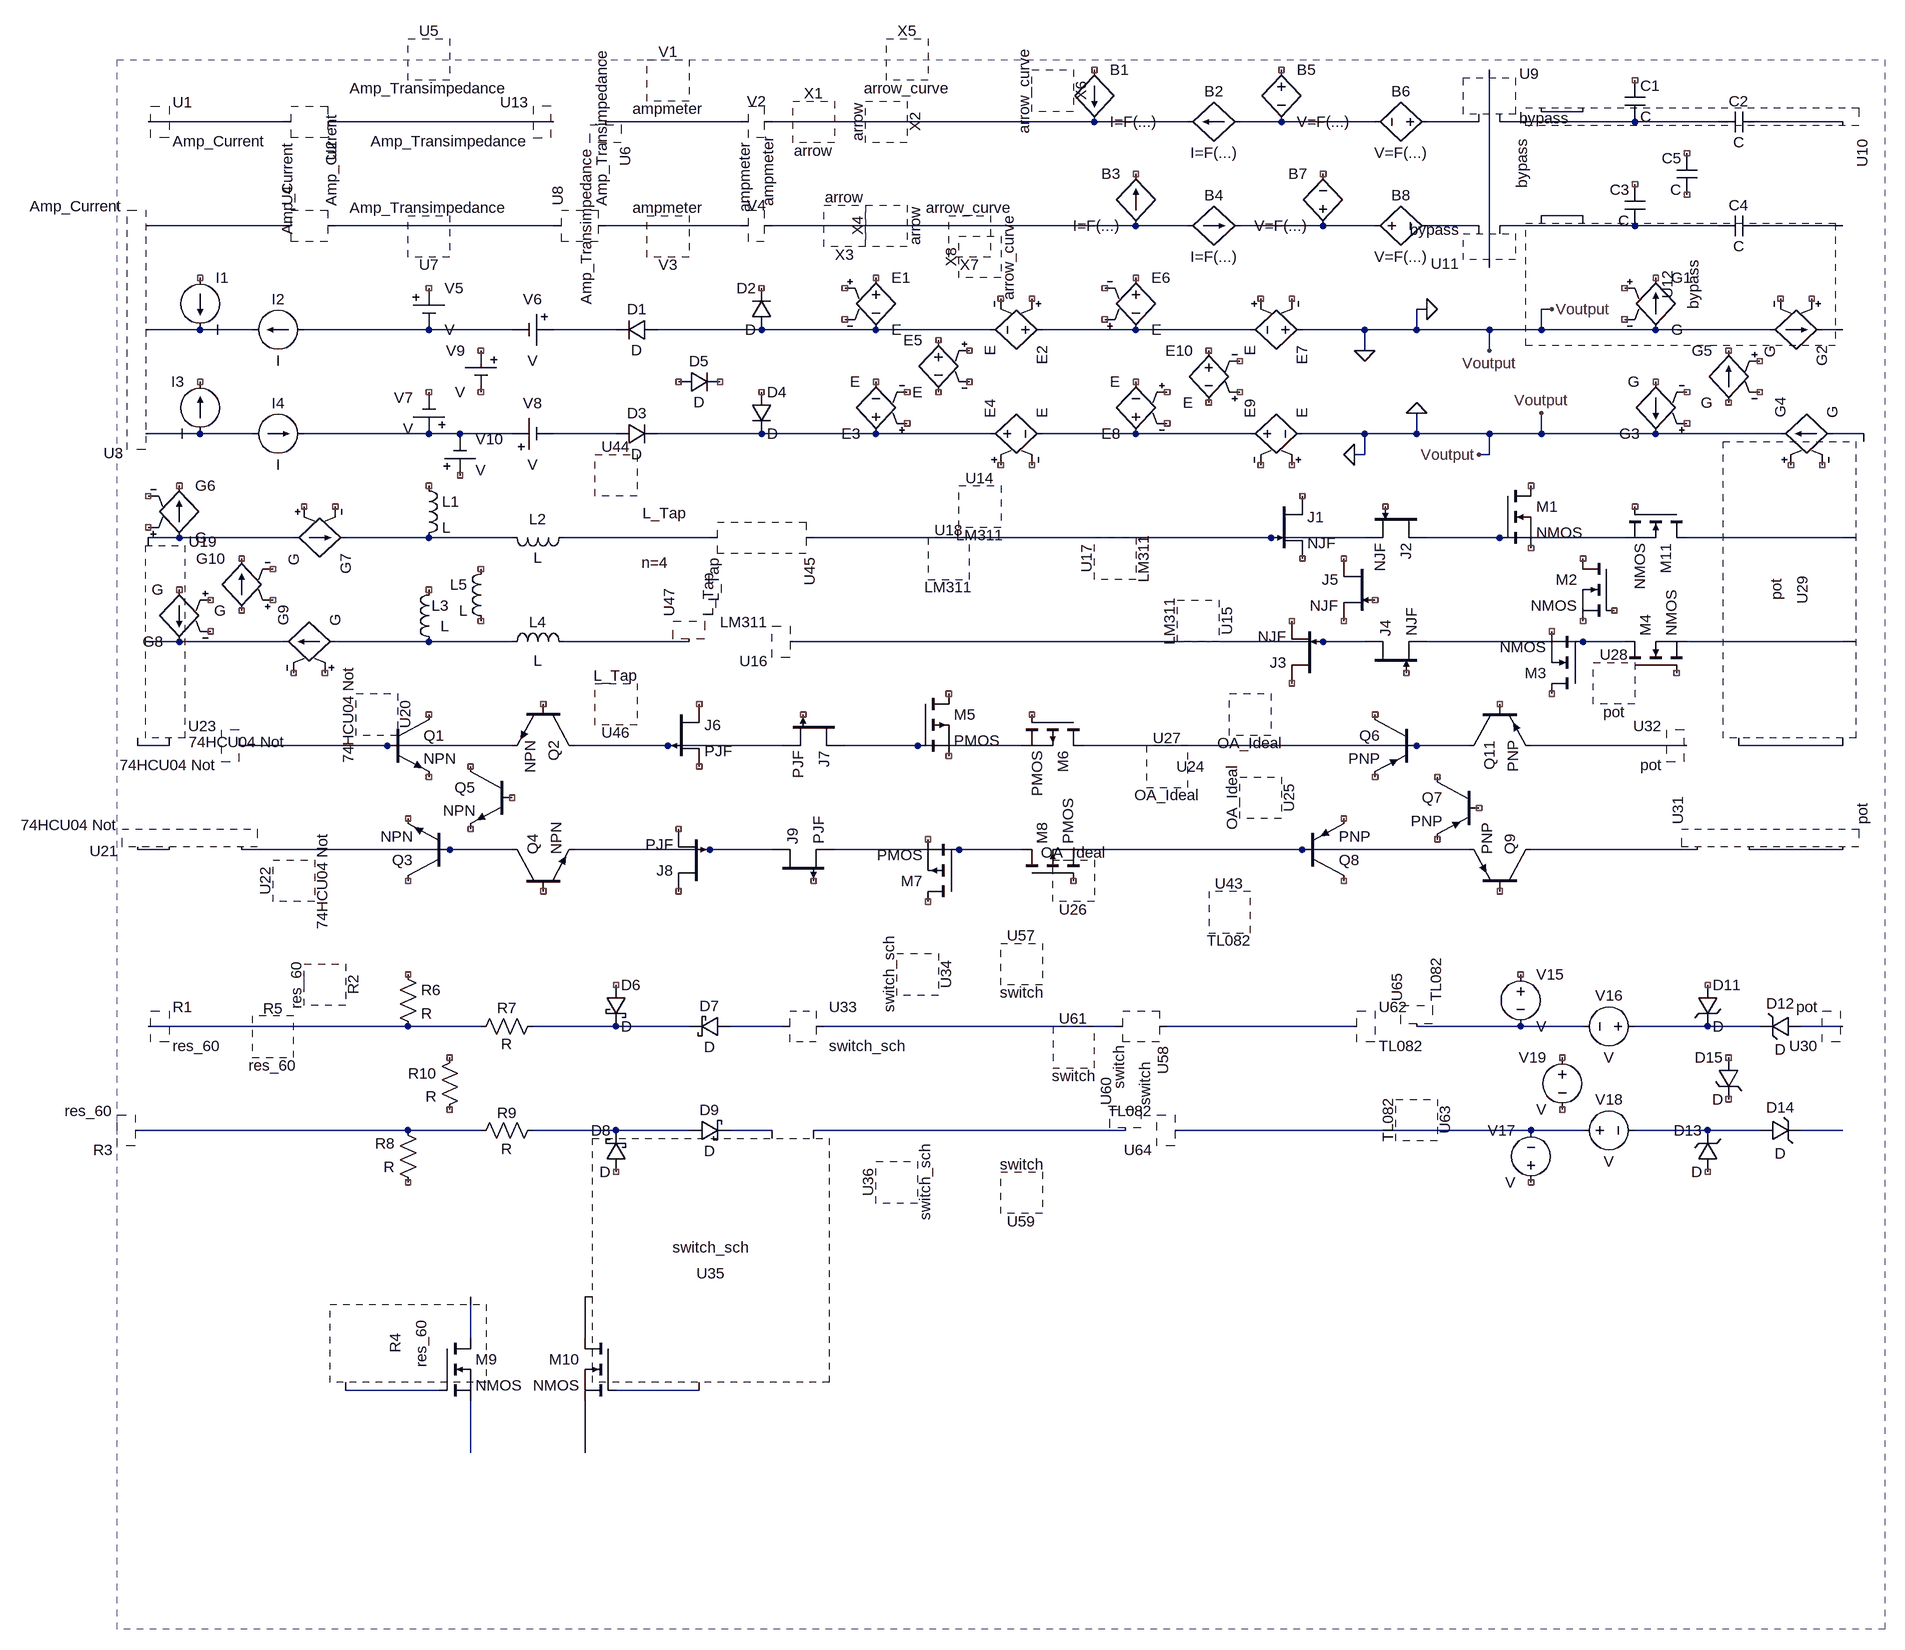
[diagram p0: schematic Full.asc]
Full.asc, the LTspice schematic file:
Version 4
SHEET 1 2724 2420
WIRE 2256 80 2192 80
WIRE 128 96 48 96
WIRE 256 96 128 96
WIRE 480 96 336 96
WIRE 672 96 480 96
WIRE 848 96 752 96
WIRE 960 96 848 96
WIRE 1504 96 1008 96
WIRE 1648 96 1504 96
WIRE 1792 96 1728 96
WIRE 1936 96 1792 96
WIRE 2096 96 2016 96
WIRE 2224 96 2128 96
WIRE 2336 96 2224 96
WIRE 2464 96 2336 96
WIRE 2656 96 2528 96
WIRE 2256 240 2192 240
WIRE 128 256 48 256
WIRE 256 256 128 256
WIRE 480 256 336 256
WIRE 672 256 480 256
WIRE 848 256 752 256
WIRE 960 256 848 256
WIRE 1568 256 1008 256
WIRE 1648 256 1568 256
WIRE 1856 256 1728 256
WIRE 1936 256 1856 256
WIRE 2096 256 2016 256
WIRE 2224 256 2128 256
WIRE 2336 256 2224 256
WIRE 2464 256 2336 256
WIRE 2656 256 2528 256
WIRE 2112 320 2112 16
WIRE 2016 384 2000 384
WIRE 2208 384 2192 384
WIRE 128 416 48 416
WIRE 208 416 128 416
WIRE 480 416 288 416
WIRE 608 416 480 416
WIRE 768 416 672 416
WIRE 992 416 832 416
WIRE 1168 416 992 416
WIRE 1344 416 1168 416
WIRE 1568 416 1424 416
WIRE 1744 416 1568 416
WIRE 1920 416 1824 416
WIRE 2000 416 2000 384
WIRE 2000 416 1920 416
WIRE 2112 416 2000 416
WIRE 2192 416 2192 384
WIRE 2192 416 2112 416
WIRE 2368 416 2192 416
WIRE 2544 416 2368 416
WIRE 2656 416 2624 416
WIRE 1920 448 1920 416
WIRE 2112 448 2112 416
WIRE 128 576 48 576
WIRE 208 576 128 576
WIRE 480 576 288 576
WIRE 528 576 480 576
WIRE 608 576 528 576
WIRE 768 576 672 576
WIRE 992 576 832 576
WIRE 1168 576 992 576
WIRE 1344 576 1168 576
WIRE 1568 576 1424 576
WIRE 1744 576 1568 576
WIRE 1920 576 1824 576
WIRE 2000 576 2000 544
WIRE 2000 576 1920 576
WIRE 2112 576 2000 576
WIRE 2192 576 2192 544
WIRE 2192 576 2112 576
WIRE 2368 576 2192 576
WIRE 2560 576 2368 576
WIRE 2688 576 2640 576
WIRE 1920 608 1920 576
WIRE 1920 608 1904 608
WIRE 2112 608 2112 576
WIRE 2112 608 2096 608
WIRE 96 736 48 736
WIRE 272 736 96 736
WIRE 480 736 352 736
WIRE 608 736 480 736
WIRE 752 736 688 736
WIRE 912 736 752 736
WIRE 1248 736 1072 736
WIRE 1776 736 1248 736
WIRE 1920 736 1776 736
WIRE 2128 736 2016 736
WIRE 2320 736 2128 736
WIRE 2656 736 2416 736
WIRE 96 896 48 896
WIRE 256 896 96 896
WIRE 480 896 336 896
WIRE 608 896 480 896
WIRE 784 896 688 896
WIRE 880 896 784 896
WIRE 1120 896 1040 896
WIRE 1856 896 1120 896
WIRE 1920 896 1856 896
WIRE 2256 896 2016 896
WIRE 2320 896 2256 896
WIRE 2656 896 2416 896
WIRE 80 1056 32 1056
WIRE 416 1056 192 1056
WIRE 608 1056 416 1056
WIRE 848 1056 704 1056
WIRE 1024 1056 848 1056
WIRE 1232 1056 1120 1056
WIRE 1392 1056 1232 1056
WIRE 1664 1056 1488 1056
WIRE 1712 1056 1664 1056
WIRE 2000 1056 1712 1056
WIRE 2080 1056 2000 1056
WIRE 2320 1056 2176 1056
WIRE 2416 1056 2320 1056
WIRE 2656 1056 2496 1056
WIRE 80 1216 32 1216
WIRE 512 1216 192 1216
WIRE 608 1216 512 1216
WIRE 912 1216 704 1216
WIRE 1008 1216 912 1216
WIRE 1296 1216 1104 1216
WIRE 1392 1216 1296 1216
WIRE 1552 1216 1488 1216
WIRE 1824 1216 1552 1216
WIRE 2080 1216 1824 1216
WIRE 2320 1216 2176 1216
WIRE 2432 1216 2320 1216
WIRE 2656 1216 2512 1216
WIRE 128 1488 48 1488
WIRE 224 1488 128 1488
WIRE 448 1488 224 1488
WIRE 560 1488 448 1488
WIRE 768 1488 640 1488
WIRE 880 1488 768 1488
WIRE 1024 1488 944 1488
WIRE 1216 1488 1088 1488
WIRE 1392 1488 1216 1488
WIRE 1536 1488 1392 1488
WIRE 1824 1488 1616 1488
WIRE 1904 1488 1824 1488
WIRE 2160 1488 2000 1488
WIRE 2256 1488 2160 1488
WIRE 2448 1488 2336 1488
WIRE 2528 1488 2448 1488
WIRE 2656 1488 2592 1488
WIRE 144 1648 32 1648
WIRE 240 1648 144 1648
WIRE 448 1648 240 1648
WIRE 560 1648 448 1648
WIRE 768 1648 640 1648
WIRE 880 1648 768 1648
WIRE 1008 1648 944 1648
WIRE 1216 1648 1072 1648
WIRE 1392 1648 1216 1648
WIRE 1552 1648 1392 1648
WIRE 1712 1648 1632 1648
WIRE 2176 1648 1712 1648
WIRE 2256 1648 2176 1648
WIRE 2448 1648 2336 1648
WIRE 2528 1648 2448 1648
WIRE 2656 1648 2592 1648
WIRE 544 1968 544 1904
WIRE 720 1968 720 1904
WIRE 496 2048 352 2048
WIRE 896 2048 768 2048
WIRE 544 2144 544 2064
WIRE 720 2144 720 2064
FLAG 1920 448 0
FLAG 2016 384 0
FLAG 1904 608 0
FLAG 2000 544 0
FLAG 2112 448 Voutput
FLAG 2208 384 Voutput
FLAG 2096 608 Voutput
FLAG 2192 544 Voutput
SYMBOL TCLib\\Amp_Current 128 0 R0
SYMATTR InstName U1
SYMBOL TCLib\\Amp_Current 352 96 R90
SYMATTR InstName U2
SYMBOL TCLib\\Amp_Current 128 272 R180
SYMATTR InstName U3
SYMBOL TCLib\\Amp_Current 240 256 R270
SYMATTR InstName U4
SYMBOL TCLib\\Amp_Transimpedance 480 0 R0
SYMATTR InstName U5
SYMBOL TCLib\\Amp_Transimpedance 768 96 R90
SYMATTR InstName U6
SYMBOL TCLib\\Amp_Transimpedance 480 272 R180
SYMATTR InstName U7
SYMBOL TCLib\\Amp_Transimpedance 656 256 R270
SYMATTR InstName U8
SYMBOL TCLib\\Special\\ampmeter 848 32 R0
SYMATTR InstName V1
SYMBOL TCLib\\Special\\ampmeter 1024 96 R90
WINDOW 0 -16 40 VBottom 2
SYMATTR InstName V2
SYMBOL TCLib\\Special\\ampmeter 848 272 R180
SYMATTR InstName V3
SYMBOL TCLib\\Special\\ampmeter 944 256 R270
WINDOW 0 16 40 VTop 2
SYMATTR InstName V4
SYMBOL TCLib\\Special\\arrow 1072 96 R0
SYMATTR InstName X1
SYMBOL TCLib\\Special\\arrow 1184 96 R90
SYMATTR InstName X2
SYMBOL TCLib\\Special\\arrow 1120 256 R180
SYMATTR InstName X3
SYMBOL TCLib\\Special\\arrow 1184 256 R270
SYMATTR InstName X4
SYMBOL TCLib\\Special\\arrow_curve 1216 0 R0
SYMATTR InstName X5
SYMBOL TCLib\\Special\\arrow_curve 1440 48 R90
SYMATTR InstName X6
SYMBOL TCLib\\Special\\arrow_curve 1312 272 R180
SYMATTR InstName X7
SYMBOL TCLib\\Special\\arrow_curve 1328 304 R270
SYMATTR InstName X8
SYMBOL bi 1504 16 R0
SYMATTR InstName B1
SYMBOL bi 1728 96 R90
WINDOW 0 -32 40 VBottom 2
WINDOW 3 32 40 VTop 2
SYMATTR InstName B2
SYMBOL bi 1568 256 R180
WINDOW 0 24 80 Left 2
WINDOW 3 24 0 Left 2
SYMATTR InstName B3
SYMBOL bi 1648 256 R270
WINDOW 0 32 40 VTop 2
WINDOW 3 -32 40 VBottom 2
SYMATTR InstName B4
SYMBOL bv 1792 0 R0
SYMATTR InstName B5
SYMBOL bv 2032 96 R90
WINDOW 0 -32 56 VBottom 2
WINDOW 3 32 56 VTop 2
SYMATTR InstName B6
SYMBOL bv 1856 272 R180
WINDOW 0 24 96 Left 2
WINDOW 3 24 16 Left 2
SYMATTR InstName B7
SYMBOL bv 1920 256 R270
WINDOW 0 32 56 VTop 2
WINDOW 3 -32 56 VBottom 2
SYMATTR InstName B8
SYMBOL TCLib\\Special\\bypass 2096 96 R0
SYMATTR InstName U9
SYMBOL TCLib\\Special\\bypass 2224 64 R90
SYMATTR InstName U10
SYMBOL TCLib\\Special\\bypass 2128 256 R180
SYMATTR InstName U11
SYMBOL TCLib\\Special\\bypass 2224 256 R270
SYMATTR InstName U12
SYMBOL current 128 336 R0
SYMATTR InstName I1
SYMBOL current 288 416 R90
WINDOW 0 -32 40 VBottom 2
WINDOW 3 32 40 VTop 2
SYMATTR InstName I2
SYMBOL current 208 576 R270
WINDOW 0 32 40 VTop 2
WINDOW 3 -32 40 VBottom 2
SYMATTR InstName I4
SYMBOL current 128 576 R180
WINDOW 0 24 80 Left 2
WINDOW 3 24 0 Left 2
SYMATTR InstName I3
SYMBOL Misc\\cell 480 352 R0
SYMATTR InstName V5
SYMBOL Misc\\cell 672 416 R90
WINDOW 0 -32 32 VBottom 2
WINDOW 3 32 32 VTop 2
SYMATTR InstName V6
SYMBOL Misc\\cell 480 576 R180
WINDOW 0 24 56 Left 2
WINDOW 3 24 8 Left 2
SYMATTR InstName V7
SYMBOL Misc\\cell 608 576 R270
WINDOW 0 32 32 VTop 2
WINDOW 3 -32 32 VBottom 2
SYMATTR InstName V8
SYMBOL Misc\\cell 560 448 M0
SYMATTR InstName V9
SYMBOL TCLib\\Amp_Transimpedance 608 112 M0
SYMATTR InstName U13
SYMBOL diode 832 400 R90
WINDOW 0 0 32 VBottom 2
WINDOW 3 32 32 VTop 2
SYMATTR InstName D1
SYMBOL diode 1008 416 R180
WINDOW 0 24 64 Left 2
WINDOW 3 24 0 Left 2
SYMATTR InstName D2
SYMBOL diode 768 592 R270
WINDOW 0 32 32 VTop 2
WINDOW 3 0 32 VBottom 2
SYMATTR InstName D3
SYMBOL diode 976 512 R0
SYMATTR InstName D4
SYMBOL diode 864 480 M90
WINDOW 0 0 32 VBottom 2
WINDOW 3 32 32 VTop 2
SYMATTR InstName D5
SYMBOL e 1168 320 R0
SYMATTR InstName E1
SYMBOL e 1440 416 R90
SYMATTR InstName E2
SYMBOL e 1168 592 R180
SYMATTR InstName E3
SYMBOL e 1328 576 R270
SYMATTR InstName E4
SYMBOL e 1264 416 M0
SYMATTR InstName E5
SYMBOL e2 1568 320 R0
SYMATTR InstName E6
SYMBOL e2 1840 416 R90
SYMATTR InstName E7
SYMBOL e2 1568 592 R180
SYMATTR InstName E8
SYMBOL e2 1728 576 R270
SYMATTR InstName E9
SYMBOL e2 1680 432 M0
SYMATTR InstName E10
SYMBOL cap 2320 32 R0
SYMATTR InstName C1
SYMBOL cap 2528 80 R90
WINDOW 0 0 32 VBottom 2
WINDOW 3 32 32 VTop 2
SYMATTR InstName C2
SYMBOL cap 2352 256 R180
WINDOW 0 24 56 Left 2
WINDOW 3 24 8 Left 2
SYMATTR InstName C3
SYMBOL cap 2464 272 R270
WINDOW 0 32 32 VTop 2
WINDOW 3 0 32 VBottom 2
SYMATTR InstName C4
SYMBOL cap 2432 144 M0
SYMATTR InstName C5
SYMBOL g 2368 320 R0
SYMATTR InstName G1
SYMBOL g 2640 416 R90
SYMATTR InstName G2
SYMBOL g 2368 592 R180
SYMATTR InstName G3
SYMBOL g 2544 576 R270
SYMATTR InstName G4
SYMBOL g 2480 432 M0
SYMATTR InstName G5
SYMBOL g2 96 640 R0
SYMATTR InstName G6
SYMBOL g2 368 736 R90
SYMATTR InstName G7
SYMBOL g2 96 912 R180
SYMATTR InstName G8
SYMBOL g2 240 896 R270
SYMATTR InstName G9
SYMBOL g2 192 752 M0
SYMATTR InstName G10
SYMBOL ind 464 640 R0
SYMATTR InstName L1
SYMBOL ind 704 720 R90
WINDOW 3 31 56 VTop 2
WINDOW 0 3 56 VBottom 2
SYMATTR InstName L2
SYMBOL ind 496 912 R180
WINDOW 3 -2 40 Right 2
WINDOW 0 -2 72 Center 2
SYMATTR InstName L3
SYMBOL ind 592 912 R270
WINDOW 3 3 56 VBottom 2
WINDOW 0 31 56 VTop 2
SYMATTR InstName L4
SYMBOL ind 576 768 M0
SYMATTR InstName L5
SYMBOL TCLib\\LM311 1328 688 R0
SYMATTR InstName U14
SYMBOL TCLib\\LM311 1664 864 R90
SYMATTR InstName U15
SYMBOL TCLib\\LM311 1040 944 R180
SYMATTR InstName U16
SYMBOL TCLib\\LM311 1536 768 R270
SYMATTR InstName U17
SYMBOL TCLib\\LM311 1280 768 M0
SYMATTR InstName U18
SYMBOL TCLib\\Special\\74HCU04\ Not 128 992 R0
SYMATTR InstName U19
SYMBOL TCLib\\Special\\74HCU04\ Not 400 1008 R90
SYMATTR InstName U20
SYMBOL TCLib\\Special\\74HCU04\ Not 144 1280 R180
SYMATTR InstName U21
SYMBOL TCLib\\Special\\74HCU04\ Not 272 1264 R270
SYMATTR InstName U22
SYMBOL TCLib\\Special\\74HCU04\ Not 256 1072 M0
SYMATTR InstName U23
SYMBOL npn 416 1008 R0
SYMATTR InstName Q1
SYMBOL npn 704 992 R90
SYMATTR InstName Q2
SYMBOL npn 512 1264 R180
SYMATTR InstName Q3
SYMBOL npn 608 1280 R270
SYMATTR InstName Q4
SYMBOL npn 608 1088 M0
SYMATTR InstName Q5
SYMBOL TCLib\\TL082 1712 1312 M0
SYMATTR InstName U43
SYMBOL TCLib\\Special\\L_Tap 768 640 R0
WINDOW 3 41 58 Left 2
WINDOW 123 39 134 Left 2
SYMATTR Value2 n=4
SYMATTR InstName U44
SYMBOL TCLib\\Special\\L_Tap 1088 720 R90
SYMATTR InstName U45
SYMBOL TCLib\\Special\\L_Tap 768 992 R180
SYMATTR InstName U46
SYMBOL TCLib\\Special\\L_Tap 864 912 R270
SYMATTR InstName U47
SYMBOL res 432 1392 R0
SYMATTR InstName R6
SYMBOL res 656 1472 R90
WINDOW 0 3 56 VBottom 2
WINDOW 3 27 56 VTop 2
SYMATTR InstName R7
SYMBOL res 464 1744 R180
WINDOW 0 36 76 Left 2
WINDOW 3 36 40 Left 2
SYMATTR InstName R8
SYMBOL res 544 1664 R270
WINDOW 0 27 56 VTop 2
WINDOW 3 3 56 VBottom 2
SYMATTR InstName R9
SYMBOL res 528 1520 M0
SYMATTR InstName R10
SYMBOL TCLib\\switch 1392 1392 R0
SYMATTR InstName U57
SYMBOL TCLib\\switch 1632 1488 R90
SYMATTR InstName U58
SYMBOL TCLib\\switch 1392 1744 R180
SYMATTR InstName U59
SYMBOL TCLib\\switch 1536 1648 R270
SYMATTR InstName U60
SYMBOL TCLib\\switch 1472 1520 M0
SYMATTR InstName U61
SYMBOL TCLib\\TL082 1904 1440 R0
SYMATTR InstName U62
SYMBOL TCLib\\TL082 2000 1632 R90
SYMATTR InstName U63
SYMBOL TCLib\\TL082 1632 1696 R180
SYMATTR InstName U64
SYMBOL TCLib\\TL082 1920 1536 R270
SYMATTR InstName U65
SYMBOL voltage 2160 1392 R0
SYMATTR InstName V15
SYMBOL voltage 2352 1488 R90
WINDOW 0 -32 56 VBottom 2
WINDOW 3 32 56 VTop 2
SYMATTR InstName V16
SYMBOL voltage 2176 1744 R180
WINDOW 0 24 96 Left 2
WINDOW 3 24 16 Left 2
SYMATTR InstName V17
SYMBOL voltage 2240 1648 R270
WINDOW 0 32 56 VTop 2
WINDOW 3 -32 56 VBottom 2
SYMATTR InstName V18
SYMBOL voltage 2224 1520 M0
SYMATTR InstName V19
SYMBOL zener 2432 1424 R0
SYMATTR InstName D11
SYMBOL zener 2592 1472 R90
WINDOW 0 -4 32 VBottom 2
WINDOW 3 36 32 VTop 2
SYMATTR InstName D12
SYMBOL zener 2464 1712 R180
WINDOW 0 24 64 Left 2
WINDOW 3 24 0 Left 2
SYMATTR InstName D13
SYMBOL zener 2528 1664 R270
WINDOW 0 36 32 VTop 2
WINDOW 3 -4 32 VBottom 2
SYMATTR InstName D14
SYMBOL zener 2496 1536 M0
SYMATTR InstName D15
SYMBOL njf 1776 672 R0
SYMATTR InstName J1
SYMBOL njf 2016 688 R90
SYMATTR InstName J2
SYMBOL njf 1856 960 R180
SYMATTR InstName J3
SYMBOL njf 1920 944 R270
SYMATTR InstName J4
SYMBOL nmos 2128 656 R0
SYMATTR InstName M1
SYMBOL nmos 2256 976 R180
SYMATTR InstName M3
SYMBOL nmos 2320 944 R270
SYMATTR InstName M4
SYMBOL pjf 848 992 R0
SYMATTR InstName J6
SYMBOL pjf 1120 1008 R90
SYMATTR InstName J7
SYMBOL pjf 912 1280 R180
SYMATTR InstName J8
SYMBOL pjf 1008 1264 R270
SYMATTR InstName J9
SYMBOL pmos 1232 976 R0
SYMATTR InstName M5
SYMBOL pmos 1488 1008 R90
SYMATTR InstName M6
SYMBOL pmos 1296 1296 R180
SYMATTR InstName M7
SYMBOL pmos 1392 1264 R270
SYMATTR InstName M8
SYMBOL TCLib\\OA_Ideal 1744 1008 R0
WINDOW 0 -114 80 Left 2
SYMATTR InstName U24
SYMBOL TCLib\\OA_Ideal 1760 1136 R90
SYMATTR InstName U25
SYMBOL TCLib\\OA_Ideal 1472 1264 R180
SYMATTR InstName U26
SYMBOL TCLib\\OA_Ideal 1616 1088 M0
SYMATTR InstName U27
SYMBOL pnp 2000 1008 M0
SYMATTR InstName Q6
SYMBOL pnp 2080 992 M90
SYMATTR InstName Q11
SYMBOL pnp 1824 1264 M180
SYMATTR InstName Q8
SYMBOL pnp 2176 1280 M270
SYMATTR InstName Q9
SYMBOL pnp 2096 1104 M0
SYMATTR InstName Q7
SYMBOL TCLib\\pot 2304 960 R0
SYMATTR InstName U28
SYMBOL TCLib\\pot 2512 1040 R90
SYMATTR InstName U29
SYMBOL TCLib\\pot 2336 1312 R180
SYMATTR InstName U30
SYMBOL TCLib\\pot 2416 1232 R270
SYMATTR InstName U31
SYMBOL TCLib\\pot 2384 1088 M0
SYMATTR InstName U32
SYMBOL schottky 752 1424 R0
SYMATTR InstName D6
SYMBOL schottky 944 1472 R90
WINDOW 0 0 32 VBottom 2
WINDOW 3 32 32 VTop 2
SYMATTR InstName D7
SYMBOL schottky 784 1712 R180
WINDOW 0 24 64 Left 2
WINDOW 3 24 0 Left 2
SYMATTR InstName D8
SYMBOL schottky 880 1664 R270
WINDOW 0 32 32 VTop 2
WINDOW 3 0 32 VBottom 2
SYMATTR InstName D9
SYMBOL TCLib\\Special\\switch_sch 1008 1472 R0
SYMATTR InstName U33
SYMBOL TCLib\\Special\\switch_sch 1232 1408 R90
SYMATTR InstName U34
SYMBOL TCLib\\Special\\switch_sch 1088 1664 R180
SYMATTR InstName U35
SYMBOL TCLib\\Special\\switch_sch 1200 1728 R270
SYMATTR InstName U36
SYMBOL nmos 496 1968 R0
SYMATTR InstName M9
SYMBOL nmos 768 1968 M0
SYMATTR InstName M10
SYMBOL TCLib\\Special\\res_60 64 1392 R0
SYMATTR InstName R1
SYMBOL TCLib\\Special\\res_60 320 1424 R90
SYMATTR InstName R2
SYMBOL TCLib\\Special\\res_60 160 1664 R180
SYMATTR InstName R3
SYMBOL TCLib\\Special\\res_60 224 1664 R270
SYMATTR InstName R4
SYMBOL Misc\\cell 528 640 M180
WINDOW 0 24 56 Left 2
WINDOW 3 24 8 Left 2
SYMATTR InstName V10
SYMBOL njf 1936 768 M0
SYMATTR InstName J5
SYMBOL nmos 2304 768 M0
SYMATTR InstName M2
SYMBOL nmos 2416 688 R90
SYMATTR InstName M11
SYMBOL TCLib\\Special\\res_60 240 1504 M0
SYMATTR InstName R5
RECTANGLE Normal 2720 2416 0 0 2

The netlist it stands for:
* Full.asc
* U1: Amp_Current (symbol TCLib\Amp_Current not available, pin order unknown); nets seen at it: N002
* U2: Amp_Current (symbol TCLib\Amp_Current not available, pin order unknown); nets seen at it: N002, N003
* U3: Amp_Current (symbol TCLib\Amp_Current not available, pin order unknown); nets seen at it: N011, N020, N026
* U4: Amp_Current (symbol TCLib\Amp_Current not available, pin order unknown); nets seen at it: N011, N012
* U5: Amp_Transimpedance (symbol TCLib\Amp_Transimpedance not available, pin order unknown); nets seen at it: 
* U6: Amp_Transimpedance (symbol TCLib\Amp_Transimpedance not available, pin order unknown); nets seen at it: N004
* U7: Amp_Transimpedance (symbol TCLib\Amp_Transimpedance not available, pin order unknown); nets seen at it: 
* U8: Amp_Transimpedance (symbol TCLib\Amp_Transimpedance not available, pin order unknown); nets seen at it: N012, N013
* V1: ampmeter (symbol TCLib\Special\ampmeter not available, pin order unknown); nets seen at it: 
* V2: ampmeter (symbol TCLib\Special\ampmeter not available, pin order unknown); nets seen at it: N004, N005
* V3: ampmeter (symbol TCLib\Special\ampmeter not available, pin order unknown); nets seen at it: 
* V4: ampmeter (symbol TCLib\Special\ampmeter not available, pin order unknown); nets seen at it: N013, N014
* X1: arrow (symbol TCLib\Special\arrow not available, pin order unknown); nets seen at it: 
* X2: arrow (symbol TCLib\Special\arrow not available, pin order unknown); nets seen at it: 
* X3: arrow (symbol TCLib\Special\arrow not available, pin order unknown); nets seen at it: 
* X4: arrow (symbol TCLib\Special\arrow not available, pin order unknown); nets seen at it: 
* X5: arrow_curve (symbol TCLib\Special\arrow_curve not available, pin order unknown); nets seen at it: 
* X6: arrow_curve (symbol TCLib\Special\arrow_curve not available, pin order unknown); nets seen at it: 
* X7: arrow_curve (symbol TCLib\Special\arrow_curve not available, pin order unknown); nets seen at it: 
* X8: arrow_curve (symbol TCLib\Special\arrow_curve not available, pin order unknown); nets seen at it: 
B1 NC_01 N005 I=F(...)
B2 N006 N005 I=F(...)
B3 N014 NC_02 I=F(...)
B4 N014 N015 I=F(...)
B5 NC_03 N006 V=F(...)
B6 N007 N006 V=F(...)
B7 N015 NC_04 V=F(...)
B8 N015 N016 V=F(...)
* U9: bypass (symbol TCLib\Special\bypass not available, pin order unknown); nets seen at it: N007, N008, N019
* U10: bypass (symbol TCLib\Special\bypass not available, pin order unknown); nets seen at it: N001, N009
* U11: bypass (symbol TCLib\Special\bypass not available, pin order unknown); nets seen at it: N016, N017, N019
* U12: bypass (symbol TCLib\Special\bypass not available, pin order unknown); nets seen at it: N010, N018, N025
I1 NC_05 N020 I
I2 N021 N020 I
I4 N026 N027 I
I3 N026 NC_06 I
V5 NC_07 N021 V
V6 N022 N021 V
V7 N027 NC_08 V
V8 N027 N028 V
V9 NC_09 NC_10 V
* U13: Amp_Transimpedance (symbol TCLib\Amp_Transimpedance not available, pin order unknown); nets seen at it: N003
D1 N023 N022 D
D2 N023 NC_11 D
D3 N028 N029 D
D4 NC_12 N029 D
D5 NC_13 NC_14 D
E1 NC_15 N023 NC_16 NC_17 E
E2 N024 N023 NC_18 NC_19 E
E3 N029 NC_20 NC_21 NC_22 E
E4 N029 N030 NC_23 NC_24 E
E5 NC_25 NC_26 NC_27 NC_28 E
E6 NC_29 N024 NC_30 NC_31 E
E7 0 N024 NC_32 NC_33 E
E8 N030 NC_34 NC_35 NC_36 E
E9 N030 0 NC_37 NC_38 E
E10 NC_39 NC_40 NC_41 NC_42 E
C1 NC_43 N008 C
C2 N009 N008 C
C3 N017 NC_44 C
C4 N017 N018 C
C5 NC_45 NC_46 C
G1 0 NC_47 NC_48 NC_49 G
G2 0 N025 NC_50 NC_51 G
G3 NC_52 0 NC_53 NC_54 G
G4 N031 0 NC_55 NC_56 G
G5 NC_57 NC_58 NC_59 NC_60 G
G6 N032 NC_61 NC_62 NC_63 G
G7 N032 N033 NC_64 NC_65 G
G8 NC_66 N038 NC_67 NC_68 G
G9 N039 N038 NC_69 NC_70 G
G10 NC_71 NC_72 NC_73 NC_74 G
L1 NC_75 N033 L
L2 N034 N033 L
L3 N039 NC_76 L
L4 N039 N040 L
L5 NC_77 NC_78 L
* U14: LM311 (symbol TCLib\LM311 not available, pin order unknown); nets seen at it: 
* U15: LM311 (symbol TCLib\LM311 not available, pin order unknown); nets seen at it: 
* U16: LM311 (symbol TCLib\LM311 not available, pin order unknown); nets seen at it: N041
* U17: LM311 (symbol TCLib\LM311 not available, pin order unknown); nets seen at it: 
* U18: LM311 (symbol TCLib\LM311 not available, pin order unknown); nets seen at it: 
* U19: 74HCU04 Not (symbol TCLib\Special\74HCU04 Not not available, pin order unknown); nets seen at it: N032, N038, N044
* U20: 74HCU04 Not (symbol TCLib\Special\74HCU04 Not not available, pin order unknown); nets seen at it: 
* U21: 74HCU04 Not (symbol TCLib\Special\74HCU04 Not not available, pin order unknown); nets seen at it: N051, N052
* U22: 74HCU04 Not (symbol TCLib\Special\74HCU04 Not not available, pin order unknown); nets seen at it: 
* U23: 74HCU04 Not (symbol TCLib\Special\74HCU04 Not not available, pin order unknown); nets seen at it: N045
Q1 NC_79 N045 NC_80 0 NPN
Q2 N046 NC_81 N045 0 NPN
Q3 NC_82 N052 NC_83 0 NPN
Q4 N052 NC_84 N053 0 NPN
Q5 NC_85 NC_86 NC_87 0 NPN
* U43: TL082 (symbol TCLib\TL082 not available, pin order unknown); nets seen at it: 
* U44: n=4 (symbol TCLib\Special\L_Tap not available, pin order unknown); nets seen at it: 
* U45: L_Tap (symbol TCLib\Special\L_Tap not available, pin order unknown); nets seen at it: N034, N035
* U46: L_Tap (symbol TCLib\Special\L_Tap not available, pin order unknown); nets seen at it: 
* U47: L_Tap (symbol TCLib\Special\L_Tap not available, pin order unknown); nets seen at it: N040
R6 NC_88 N058 R
R7 N059 N058 R
R8 NC_89 N066 R
R9 N066 N067 R
R10 NC_90 NC_91 R
* U57: switch (symbol TCLib\switch not available, pin order unknown); nets seen at it: 
* U58: switch (symbol TCLib\switch not available, pin order unknown); nets seen at it: N061, N062
* U59: switch (symbol TCLib\switch not available, pin order unknown); nets seen at it: 
* U60: switch (symbol TCLib\switch not available, pin order unknown); nets seen at it: N069
* U61: switch (symbol TCLib\switch not available, pin order unknown); nets seen at it: 
* U62: TL082 (symbol TCLib\TL082 not available, pin order unknown); nets seen at it: N062
* U63: TL082 (symbol TCLib\TL082 not available, pin order unknown); nets seen at it: 
* U64: TL082 (symbol TCLib\TL082 not available, pin order unknown); nets seen at it: N070
* U65: TL082 (symbol TCLib\TL082 not available, pin order unknown); nets seen at it: N063
V15 NC_92 N063 V
V16 N064 N063 V
V17 NC_93 N070 V
V18 N070 N071 V
V19 NC_94 NC_95 V
D11 NC_96 N064 D
D12 N065 N064 D
D13 NC_97 N071 D
D14 N071 N072 D
D15 NC_98 NC_99 D
J1 NC_100 N035 NC_101 NJF
J2 N036 NC_102 N035 NJF
J3 NC_103 N041 NC_104 NJF
J4 N041 NC_105 N042 NJF
M1 NC_106 N036 NC_107 NC_107 NMOS
M3 NC_108 N042 NC_109 NC_109 NMOS
M4 N042 NC_110 N043 N043 NMOS
J6 NC_111 N046 NC_112 PJF
J7 N047 NC_113 N046 PJF
J8 NC_114 N053 NC_115 PJF
J9 N053 NC_116 N054 PJF
M5 NC_117 N047 NC_118 NC_118 PMOS
M6 N048 NC_119 N047 N047 PMOS
M7 NC_120 N054 NC_121 NC_121 PMOS
M8 N054 NC_122 N055 N055 PMOS
* U24: OA_Ideal (symbol TCLib\OA_Ideal not available, pin order unknown); nets seen at it: 
* U25: OA_Ideal (symbol TCLib\OA_Ideal not available, pin order unknown); nets seen at it: 
* U26: OA_Ideal (symbol TCLib\OA_Ideal not available, pin order unknown); nets seen at it: 
* U27: OA_Ideal (symbol TCLib\OA_Ideal not available, pin order unknown); nets seen at it: 
Q6 NC_123 N048 NC_124 0 PNP
Q11 N048 NC_125 N049 0 PNP
Q8 NC_126 N055 NC_127 0 PNP
Q9 N056 NC_128 N055 0 PNP
Q7 NC_129 NC_130 NC_131 0 PNP
* U28: pot (symbol TCLib\pot not available, pin order unknown); nets seen at it: 
* U29: pot (symbol TCLib\pot not available, pin order unknown); nets seen at it: N031, N037, N043, N050
* U30: pot (symbol TCLib\pot not available, pin order unknown); nets seen at it: N065
* U31: pot (symbol TCLib\pot not available, pin order unknown); nets seen at it: N056, N057
* U32: pot (symbol TCLib\pot not available, pin order unknown); nets seen at it: N049
D6 NC_132 N059 D
D7 N060 N059 D
D8 NC_133 N067 D
D9 N067 N068 D
* U33: switch_sch (symbol TCLib\Special\switch_sch not available, pin order unknown); nets seen at it: N060, N061
* U34: switch_sch (symbol TCLib\Special\switch_sch not available, pin order unknown); nets seen at it: 
* U35: switch_sch (symbol TCLib\Special\switch_sch not available, pin order unknown); nets seen at it: N068, N069, N074, N076
* U36: switch_sch (symbol TCLib\Special\switch_sch not available, pin order unknown); nets seen at it: 
M9 N073 N075 N077 N077 NMOS
M10 N074 N076 N078 N078 NMOS
* R1: res_60 (symbol TCLib\Special\res_60 not available, pin order unknown); nets seen at it: N058
* R2: res_60 (symbol TCLib\Special\res_60 not available, pin order unknown); nets seen at it: 
* R3: res_60 (symbol TCLib\Special\res_60 not available, pin order unknown); nets seen at it: N066
* R4: res_60 (symbol TCLib\Special\res_60 not available, pin order unknown); nets seen at it: N073, N075
V10 NC_134 N027 V
J5 NC_135 NC_136 NC_137 NJF
M2 NC_138 NC_139 NC_140 NC_140 NMOS
M11 N037 NC_141 N036 N036 NMOS
* R5: res_60 (symbol TCLib\Special\res_60 not available, pin order unknown); nets seen at it: 
.model D D
.lib standard.dio
.model NPN NPN
.model PNP PNP
.lib standard.bjt
.model NJF NJF
.model PJF PJF
.lib standard.jft
.model NMOS NMOS
.model PMOS PMOS
.lib standard.mos
.backanno
.end